# Altium schematic sheet X50328MSB2GI.schdoc
size 127 x 101 mm
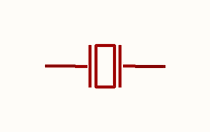
[diagram p0: X50328MSB2GI.schdoc]

## Parts
X?  x50328msb2gi  [CRYSTAL-SMD_L5.0-W3.2]  (value not drawn)

## Nets

Not connected (* = marked no-connect by the designer): X? 1(OSC1) 2(OSC2)

## Library data of the parts
X? = x50328msb2gi: 晶振类型:贴片晶振;频率:8MHz;常温频差:±10ppm;负载电容:20pF;频率稳定度:±20ppm;; Manufacturer: YXC(扬兴晶振); AddInBom: yes; ModelId: d7c39c66443246ff83c2003c1e1eb6f1; ModelTransform: 196.85,125.984,0,0,0,0,0,0,0; Value: 8MHz; Normal temperature Frequency Tolerance: ±10ppm; Load Capacitance: 20pF; Frequency Stability: ±20ppm; Symbol: X50328MSB2GI; LCSC Part Name: YSX530GA 8MHZ 2P 5032 20PF ±10PPM -40~85℃ (±20PPM); SupplierPart: C115962; ManufacturerPart: X50328MSB2GI; Supplier Footprint: SMD5032-2P; JLCPCB Part Class: Basic Part; Datasheet: https://item.szlcsc.com/datasheet/X50328MSB2GI/117214.html; Supplier: LCSC; ConvertToPcb: yes; FootprintName: CRYSTAL-SMD_L5.0-W3.2; ModelName: CRYSTAL-SMD_L5.0-W3.2; Type: 贴片晶振; Operating Temperature: -40℃~+85℃